# Altium schematic sheet RTCMK RTC.SchDoc: RTCMK RTC
size Letter; SheetNumber: 4; SheetTotal: 11
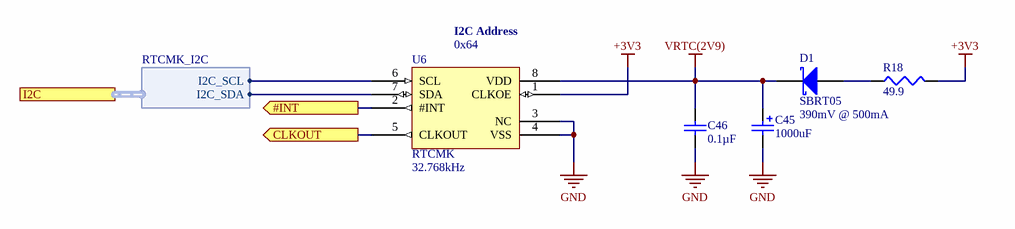
[diagram p0: RTCMK RTC.SchDoc]

## Parts
C45  value 1000uF  [AVX-F722824M]  (hidden comment: Cap Pol1)
C46  value 0.1µF  [TDK-CGA2B]  (hidden comment: Cap)
D1  SBRT05  Voltage - Forward (Max): 390mV @ 500mA  [DIOD-X2-DFN1006-2]
R18  value 49.9  [PANA-ERJ2R]  (hidden comment: Res3)
U6  RTCMK  value 32.768kHz  [ABR-RTCMK]

## Ports
#INT (out), CLKOUT (out), I2C (harness RTCMK_I2C)

## Harnesses
RTCMK_I2C: I2C_SCL, I2C_SDA

## Nets
+3V3: R18.2 U6.1(CLKOE)
GND: C45.2 C46.2 U6.3(NC) U6.4(VSS)
VRTC(2V9): C45.1 C46.1 D1.2(K) U6.8(VDD)
#INT: U6.2(#INT) ; port #INT
CLKOUT: U6.5(CLKOUT) ; port CLKOUT
NetD1_1: D1.1(A) R18.1
NetU6_6: U6.6(SCL) ; port I2C.I2C_SCL
NetU6_7: U6.7(SDA) ; port I2C.I2C_SDA

## Notes on the sheet
- (near U6) I2C Address
- (near U6) 0x64
- (the "License"); you may not use or redistribute this file except in compliance with the License. You
- This file and the information within it are licensed under the terms of the Apache License, Version 2.0
- Copyright
- Unless required by applicable law or agreed to in writing, content distributed under the License is
- distributed on an "AS IS" BASIS, WITHOUT WARRANTIES OR CONDITIONS OF ANY KIND,
- either express or implied. See the License for the specific language governing permissions and
- limitations under the License.
- may obtain a copy of the License at:
- http://www.apache.org/licenses/LICENSE-2.0
- Title
- Size:
- Date:
- Letter
- Number:
- Time:
- Revision:
- Sheet
- of
- University of Alberta
- Deptartment of Electrical
- and Computer Engineering
- Edmonton AB, Canada
- T6G 1H9
- File:

## Library data of the parts
C45 = PC-AVX-00233: CAP TANT 1000UF 10V 20% 2824; Manufacturer Part Number: F721A108MMCAQ2; Index: 233; Designator: C?; Equivalent Series Resistance: 140 mOhm @ 100kHz; Published: 2018-08-09; LatestRevisionDate: 2018-08-09; LatestRevisionNote: ...; PackageReference: 2824 (7260 metric); Publisher: AlbertaSat; PackageDescription: Chip Capacitor, 2-Leads, Body 7.20x6.00mm, IPC Low Density; Part Number: PC-AVX-00233; Supplier Part Number 1: 478-11457-1-ND; Supplier 1: Digi-key; Supplier Part Number 2: 581-F721A108MMCAQ2; Supplier 2: Mouser; Supplier Link: #https://www.digikey.ca/products/en?keywords=478-11457-1-ND#; Tolerance: ±20%; Voltage - Rated: 10V; Applications: General Purpose
C46 = PC-TDK-02259: CAP CER 0.1UF 50V X7R 0402; Manufacturer Part Number: CGA2B3X7R1H104K050BB; Index: 2259; Designator: C?; Tolerance: ±10%; Published: 2016-03-16; LatestRevisionDate: 2016-03-16; LatestRevisionNote: ...; PackageReference: 0402 (1005 Metric); Publisher: AlbertaSat; PackageDescription: Radial Cap, Thru-Hole; 2 Leads; 0.3 in Pin Spacing; Part Number: PC-TDK-02259; Supplier Part Number 1: 445-6899-1-ND; Supplier 1: Digi-key; Supplier Link: http://www.digikey.ca/product-search/en?keywords=445-6899-1-ND; Voltage - Rated: 50V; Temperature Coefficient: X7R; Applications: Automotive
D1 = 29: SUPER BARRIER RECTIFIER X2-DFN10; Part Number: 29; Manufacturer Part Number: SBRT05U20LPS-7B; Designator: D?; Published: 8-Jun-2000; LatestRevisionDate: 17-Jul-2002; LatestRevisionNote: Re-released for DXP Platform.; PackageReference: DFN 0402 (1006 Metric); Publisher: Altium Limited; PackageDescription: DO-214-AA/SMB; 2 C-Bend Leads; Body 5.3 x 3.6 mm, inc. leads (LxW); Code_JEDEC: DO-214-AA; Supplier Part Number 1: SBRT05U20LPS-7BDICT-ND; Supplier 1: Digi-Key; Supplier Part Number 2: 621-SBRT05U20LPS-7B; Supplier 2: Mouser; Supplier Link: #https://www.digikey.ca/products/en?keywords=SBRT05U20LPS-7BDICT-ND#
R18 = 13732: RES SMD 49.9 OHM 1% 1/10W 0402; Part Number: 13732; Manufacturer Part Number: ERJ-2RKF49R9X; Designator: R?; Power: 0.1W, 1/10W; Temperature Coefficient: ±100ppm/°C; Published: 8-Jun-2000; LatestRevisionDate: 29-May-2009; LatestRevisionNote: IPC-7351 Footprint Added.; PackageReference: 0402 (1005 Metric); Publisher: Altium Limited; PackageDescription: Chip Resistor, 2-Leads, Body 1.00x0.50mm, IPC Low Density; Supplier Part Number 1: P49.9LCT-ND; Supplier 1: Digi-Key; Supplier Link: http://www.digikey.ca/product-search/en?keywords=P49.9LCT-ND; Tolerance: ±1%
U6 = PU-ABR-00037: IC RTC CLK/CALENDAR I2C 8-SMT; Manufacturer Part Number: AB-RTCMK-32.768KHZ-T3; Index: 37; Part Number: PU-ABR-00037; Supplier Part Number 1: 535-11916-1-ND; Supplier 1: Digi-key; Supplier Part Number 2: 815-AB-RTCMK-32.7KT3; Supplier 2: Mouser; Publisher: AlbertaSat; Published: 2018-04-23; LatestRevisionDate: 2018-04-23; LatestRevisionNote: ...; PackageReference: 8-SMD Module; PackageDescription: 8-SMD Module; Supplier Link: https://www.digikey.ca/product-detail/en/abracon-llc/AB-RTCMK-32.768KHZ-T3/535-11916-1-ND/3601050